# Altium project EDISON_ARDUINO_HVM_8_26_OLD.PrjPcb (part 2 of 2)

## Sheet 04) UART to USB debug p.SchDoc
size 386 x 246 mm
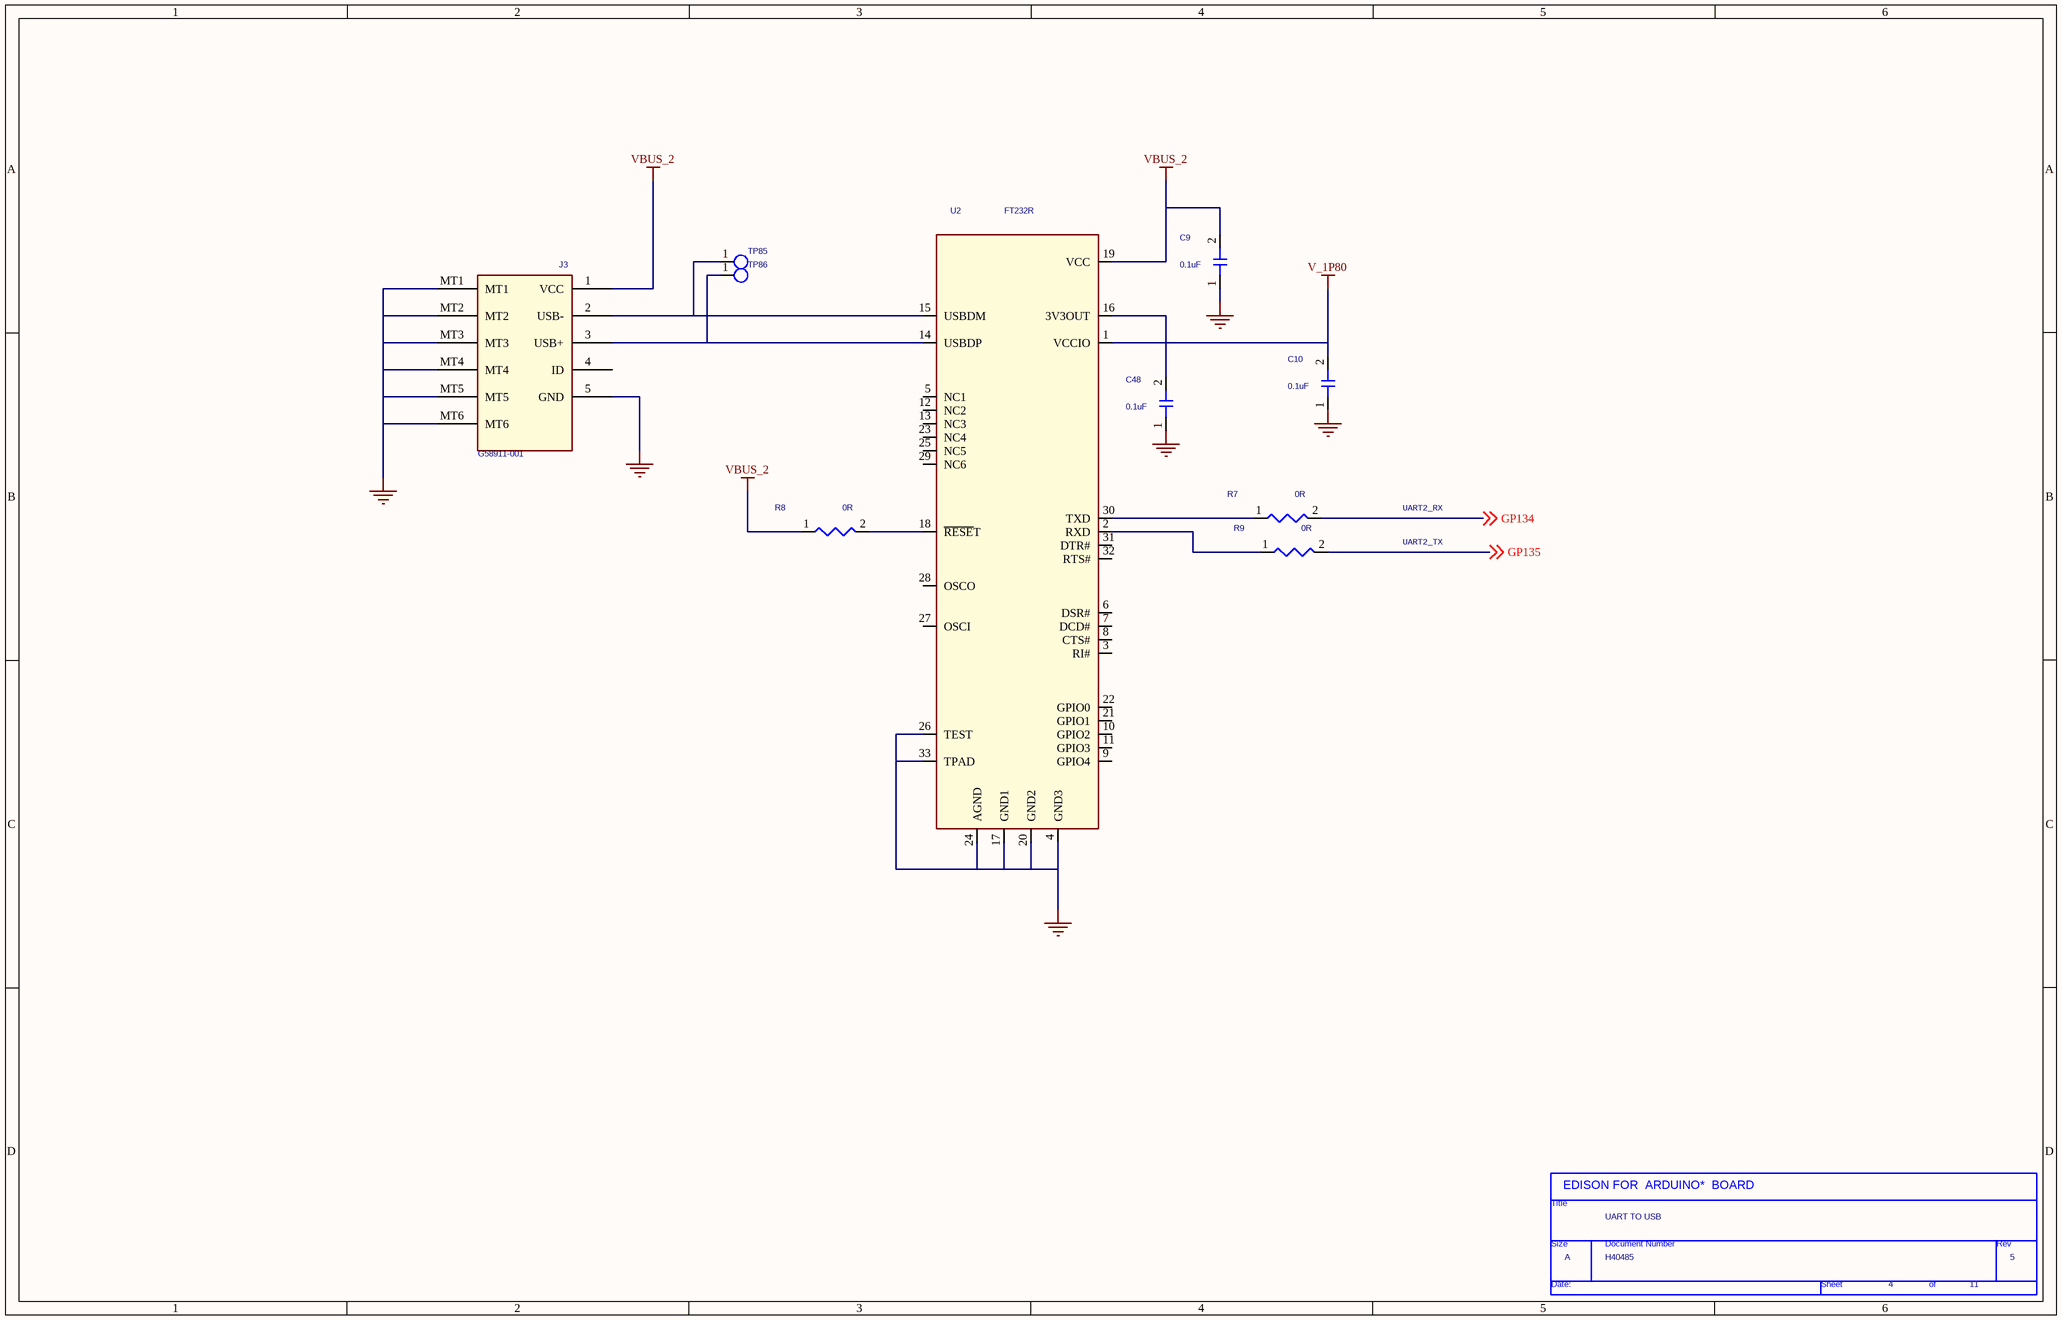
[diagram p13: 04) UART to USB debug p.SchDoc]

### Parts
(Parts that share a designator on the sheet are numbered #1, #2 ... from top to bottom, then left to right.)
*#8  Page Count: 11  Page Number: 4  Page Size: A  Title: UART TO USB  RevCode: 5  Doc: H40485  (hidden comment: TitleBlock0)  (graphical)
C9  0.1uF  [C0201]
C10  0.1uF  [C0201]
C48  0.1uF  [C0201]
J3  G58911-001  [RCPT_USB_5P_DIP_SM]
R7  0R  [0603.PRT]
R8  0R  [0603.PRT]
R9  0R  [0603.PRT]
TP85  30 MIL TESTPAD  [TESTPAD_C80]  (value not drawn)
TP86  30 MIL TESTPAD  [TESTPAD_C80]  (value not drawn)
U2  FT232R  [lcc32_p5mm_3p2sq_nonc]

### Nets
GND: C9.1(END1) C10.1(END1) C48.1(END1) J3.5(GND) J3.MT1 J3.MT2 J3.MT3 J3.MT4 J3.MT5 J3.MT6 U2.4(GND3) U2.17(GND1) U2.20(GND2) U2.24(AGND) U2.26(TEST) U2.33(TPAD)  [project net PWRBTN_GND]
V_1P80: C10.2(END2) U2.1(VCCIO)
VBUS_2: C9.2(END2) J3.1(VCC) R8.1 U2.19(VCC)
GP134: R7.2 ; off-sheet GP134
GP135: R9.2 ; off-sheet GP135
NetC48_2: C48.2(END2) U2.16(3V3OUT)
NetJ3_2: J3.2(USB-) TP85.1 U2.15(USBDM)
NetJ3_3: J3.3(USB+) TP86.1 U2.14(USBDP)
NetR7_1: R7.1 U2.30(TXD)
NetR8_2: R8.2 U2.18(~{RESE}T)
NetR9_1: R9.1 U2.2(RXD)

Not connected (* = marked no-connect by the designer): J3 4(ID); U2 3(RI#) 5(NC1) 6(DSR#) 7(DCD#) 8(CTS#) 9(GPIO4) 10(GPIO2) 11(GPIO3) 12(NC2) 13(NC3) 21(GPIO1) 22(GPIO0) 23(NC4) 25(NC5) 27(OSCI) 28(OSCO) 29(NC6) 31(DTR#) 32(RTS#)

### Notes on the sheet
- UART2_RX
- UART2_TX
- (in symbol TitleBlock0) EDISON FOR  ARDUINO*  BOARD; Title; Size; Document Number; Rev; Date:; Sheet; of

### Library data of the parts
C9 C10 C48 = CAP: as C49 on sheet 10) Button and I_O Conn; VOLTAGE: ?; PERC: ?; PATH: ?
J3 = CON4,USB,RA,_1: CONN,MISC,5P,MICRO USB,B TYPE,RECEPT,2013499-1; BOM: x; LEAD_FREE: YES; NO_STUFF: .; FINANCE: x; IPN: G58911-001; DEVICE: G58911-001; PART_NUMBER: G58911-001
R7 R8 = R_0: as R123 on sheet 10) Button and I_O Conn
R9 = R_0: as R10 on sheet 05) SPI ADC AND SWIZZLE
TP85 TP86 = TestPad,C80,SMT: as TP1 on sheet 11) TEST POINTS; BOM: x; PART_NUMBER: TESTPAD_30; NO_STUFF: NO_STUFF
U2 = FT232R_0: IC,VLSI,OTHER,FT232,QFN,32; PART_NUMBER: H40970-001; MFG PN: FT232RQ-REEL
*#8 = TitleBlock0: Page Create Date: March  8, 1995

## Sheet 01) Title Page.SchDoc
size 514 x 328 mm
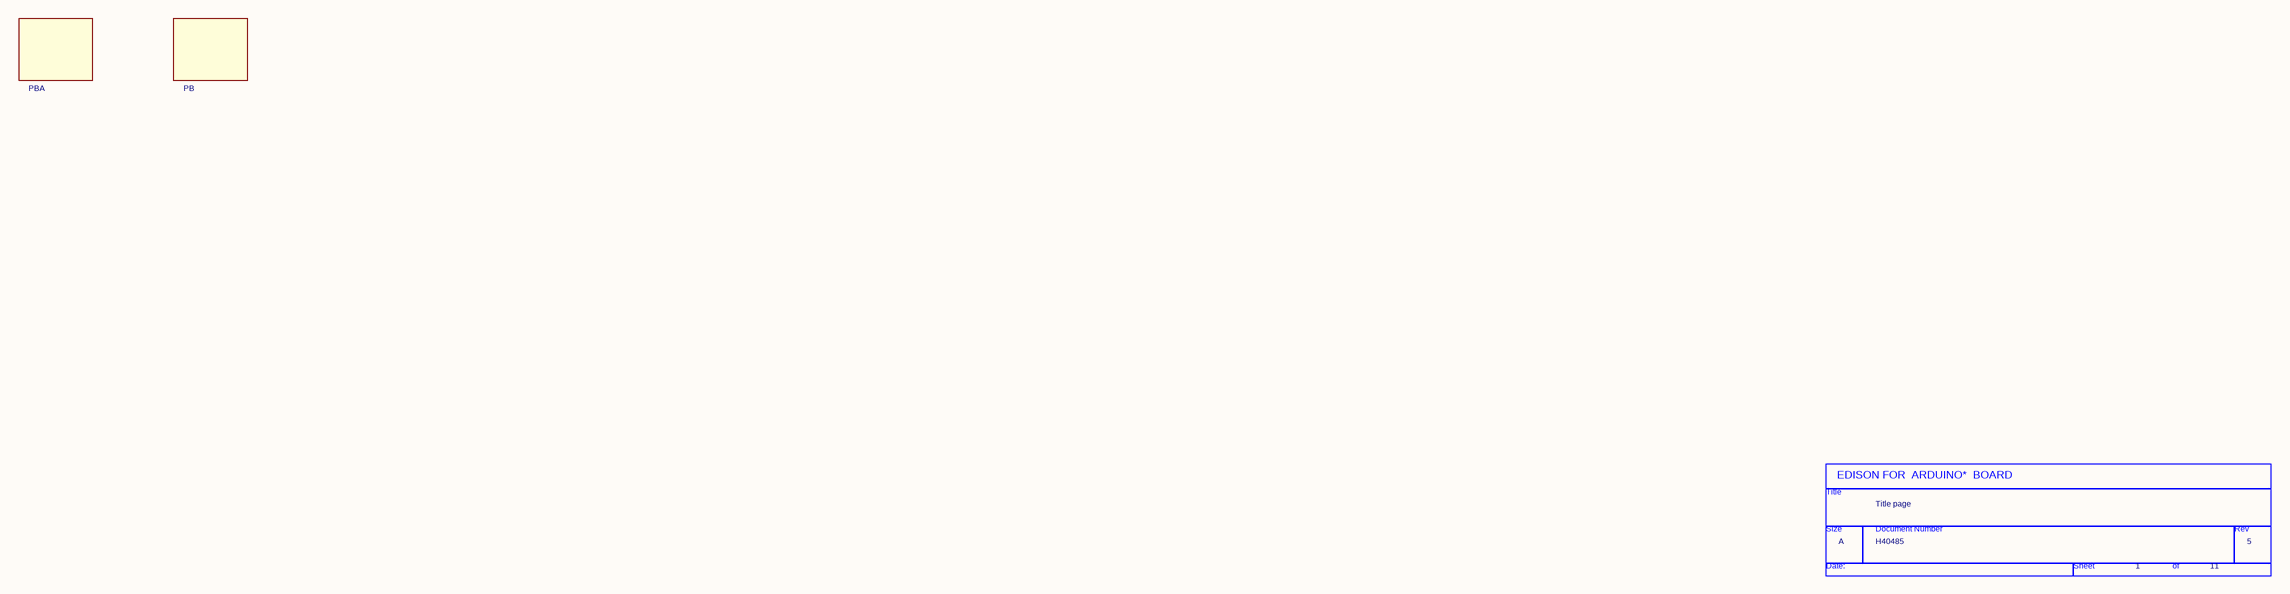
[diagram p14: 01) Title Page.SchDoc]

### Parts
(Parts that share a designator on the sheet are numbered #1, #2 ... from top to bottom, then left to right.)
*#9  Page Count: 11  Page Number: 1  Page Size: A  Title: Title page  RevCode: 5  Doc: H40485  (hidden comment: TitleBlock0)  (graphical)
A1  PBA
A2  PB

### Notes on the sheet
- (in symbol TitleBlock0) EDISON FOR  ARDUINO*  BOARD; Title; Size; Document Number; Rev; Date:; Sheet; of

### Library data of the parts
A1 = PBA: PBA, EDISON ARDUINO; PART_NUMBER: H40485-400
A2 = PBA: PB, EDISON ARDUINO, 1-UP; PART_NUMBER: H40482-004
*#9 = TitleBlock0: Page Create Date: March  8, 1995

## Sheet 03) POWER SUPPLIES.SchDoc
size 447 x 332 mm
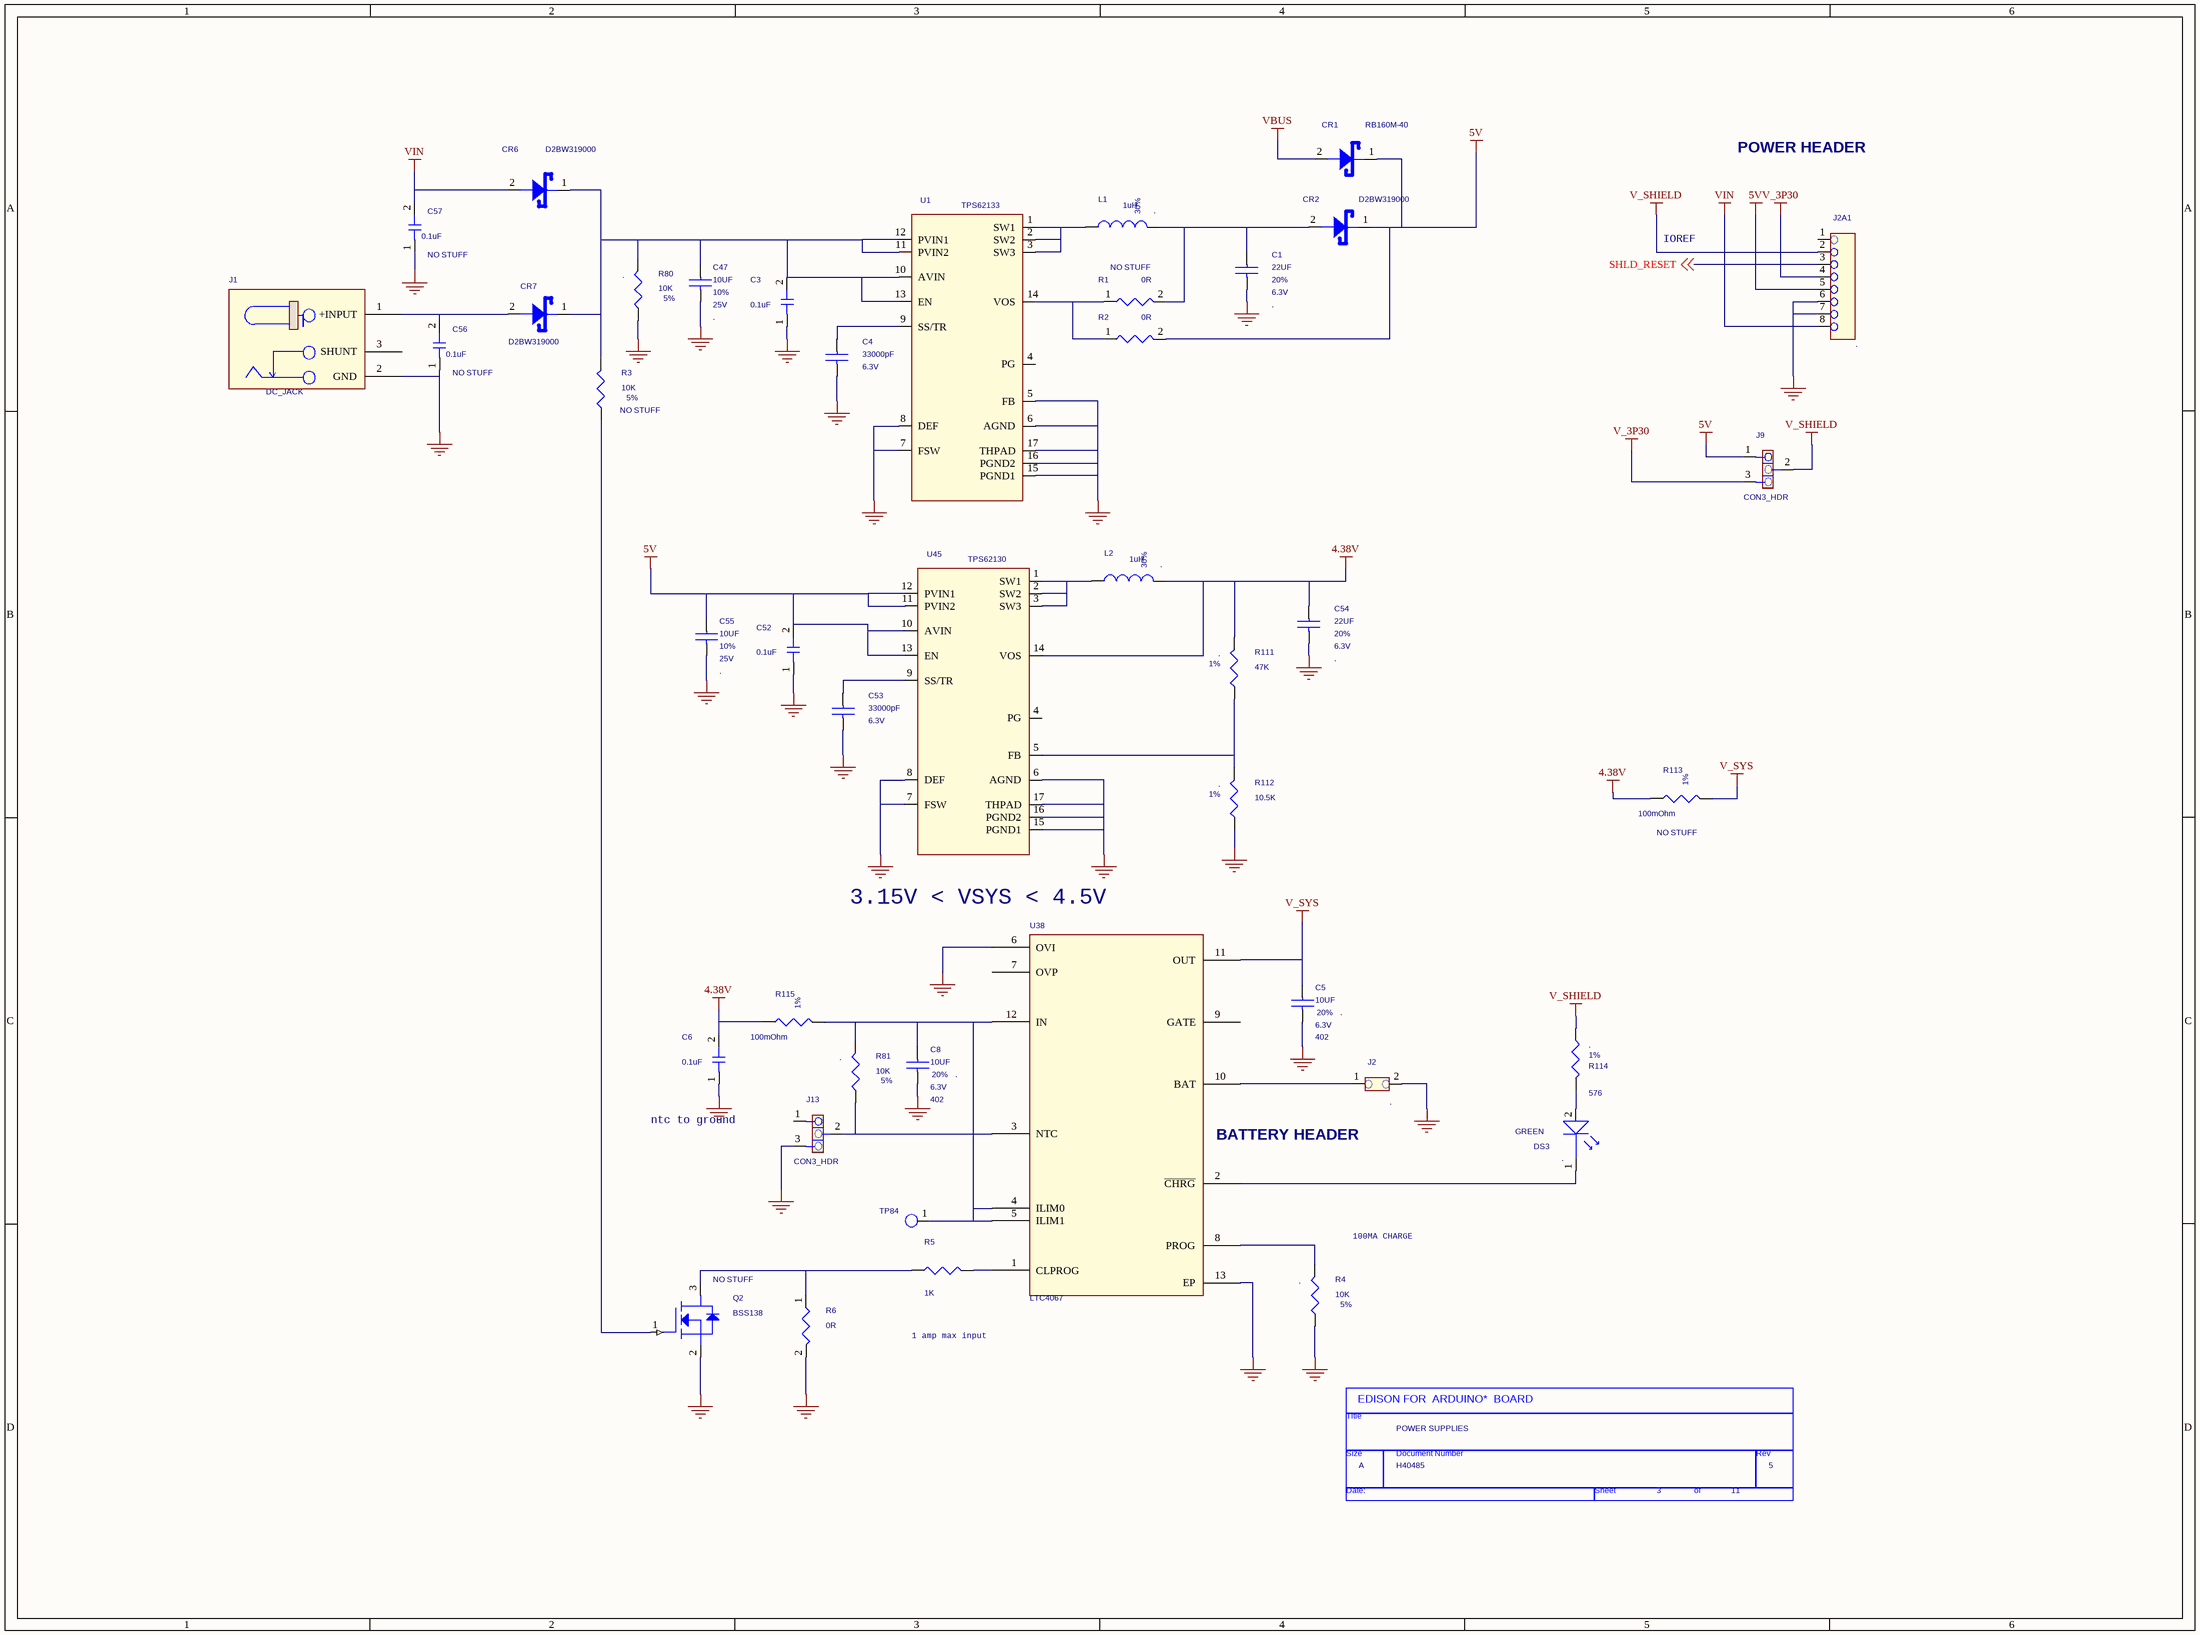
[diagram p15: 03) POWER SUPPLIES.SchDoc]

### Parts
(Parts that share a designator on the sheet are numbered #1, #2 ... from top to bottom, then left to right.)
*#10  Page Count: 11  Page Number: 3  Page Size: A  Title: POWER SUPPLIES  RevCode: 5  Doc: H40485  (hidden comment: TitleBlock0)  (graphical)
C1  22UF  TOLERANCE: 20%  RATING: 6.3V  NO_STUFF: .  [SMC0603_hi_value]
C3  0.1uF  [C0201]
C4  33000pF  RATING: 6.3V  [SMC0201]
C5  10UF  SIZE: 402  NO_STUFF: .  TOL: 20%  RATING: 6.3V  [SMC0402]
C6  0.1uF  [C0201]
C8  10UF  SIZE: 402  NO_STUFF: .  TOL: 20%  RATING: 6.3V  [SMC0402]
C47  10UF  RATING: 25V  NO_STUFF: .  TOL: 10%  [SMC0805_1p35h]
C52  0.1uF  [C0201]
C53  33000pF  RATING: 6.3V  [SMC0201]
C54  22UF  TOLERANCE: 20%  RATING: 6.3V  NO_STUFF: .  [SMC0603_hi_value]
C55  10UF  RATING: 25V  NO_STUFF: .  TOL: 10%  [SMC0805_1p35h]
C56  0.1uF  [C0201]
C57  0.1uF  [C0201]
CR1  RB160M-40  [SOD123_67x106]
CR2  D2BW319000  [SCR_27X17MA]
CR6  D2BW319000  [SCR_27X17MA]
CR7  D2BW319000  [SCR_27X17MA]
DS3  GREEN  NO_STUFF: .  [smled0402]
J1  DC_JACK  [JK_3P_RA]
J2  NO_STUFF: .  [102276-001]  (hidden comment: CON2_HDR)
J2A1  NO_STUFF: .  [1x8hdr_p100in_th]  (hidden comment: CON8_HDR)
J9  CON3_HDR  [1x3hdr_p100in_th]
J13  CON3_HDR  [1x3hdr_p100in_th]
L1  1uH  NO_STUFF: .  TOL: 30%  [SML0805]
L2  1uH  NO_STUFF: .  TOL: 30%  [SML0805]
Q2  BSS138  NO_STUFF: NO STUFF  [SOT23]
R1  0R  [0603.PRT]
R2  0R  [0603.PRT]
R3  10K  NO_STUFF: NO STUFF  TOL: 5%  [SMR0201]
R4  10K  NO_STUFF: .  TOL: 5%  [SMR0201]
R5  1K  [RC0603]
R6  0R  [0603.PRT]
R80  10K  NO_STUFF: .  TOL: 5%  [SMR0201]
R81  10K  NO_STUFF: .  TOL: 5%  [SMR0201]
R111  47K  TOL: 1%  NO_STUFF: .  [SMR0201]
R112  10.5K  TOL: 1%  NO_STUFF: .  [SMR0201]
R113  100mOhm  TOL: 1%  NO_STUFF: NO STUFF  [SMR0402]
R114  576  NO_STUFF: .  TOL: 1%  [SMR0201]
R115  100mOhm  TOL: 1%  [SMR0402]
TP84  30 MIL TESTPAD  [TESTPAD_C80]  (value not drawn)
U1  TPS62133  [QFN16_3X3]
U38  LTC4067  [lcc12_p5mm_3x4mm]
U45  TPS62130  [QFN16_3X3]

### Nets
4.38V: C6.2(END2) C54.1 L2.2 R111.2 R113.1 R115.1 U45.14(VOS)
5V: C52.2(END2) C55.1 CR1.1(Cathode) CR2.1(Cathode) J2A1.5 J9.1 R2.2 U45.10(AVIN) U45.11(PVIN2) U45.12(PVIN1) U45.13(EN)
GND: C1.2 C3.1(END1) C4.2 C5.2 C6.1(END1) C8.2 C47.2 C52.1(END1) C53.2 C54.2 C55.2 C56.1(END1) C57.1(END1) J1.2(GND) J2.2 J2A1.6 J2A1.7 J13.3 Q2.2(S) R4.1 R6.2 R80.1 R112.1 U1.5(FB) U1.6(AGND) U1.7(FSW) U1.8(DEF) U1.15(PGND1) U1.16(PGND2) U1.17(THPAD) U38.6(OVI) U38.13(EP) U45.6(AGND) U45.7(FSW) U45.8(DEF) U45.15(PGND1) U45.16(PGND2) U45.17(THPAD)  [project net PWRBTN_GND]
V_3P30: J2A1.4 J9.3
V_SHIELD: J2A1.2 J9.2 R114.2
V_SYS: C5.1 R113.2 U38.11(OUT)
VBUS: CR1.2(Anode)
VIN: C57.2(END2) CR6.2(Anode) J2A1.8
SHLD_RESET: J2A1.3 ; off-sheet SHLD_RESET
NetC1_1: C1.1 CR2.2(Anode) L1.2 R1.2
NetC3_2: C3.2(END2) C47.1 CR6.1(Cathode) CR7.1(Cathode) R3.2 R80.2 U1.10(AVIN) U1.11(PVIN2) U1.12(PVIN1) U1.13(EN)
NetC4_1: C4.1 U1.9(SS/TR)
NetC8_1: C8.1 R81.2 R115.2 TP84.1 U38.4(ILIM0) U38.5(ILIM1) U38.12(IN)
NetC53_1: C53.1 U45.9(SS/TR)
NetC56_2: C56.2(END2) CR7.2(Anode) J1.1(+INPUT)
NetDS3_1: DS3.1(LED1) U38.2(~{CHRG})
NetDS3_2: DS3.2(LED2) R114.1
NetJ2_1: J2.1 U38.10(BAT)
NetJ13_2: J13.2 R81.1 U38.3(NTC)
NetL1_1: L1.1 U1.1(SW1) U1.2(SW2) U1.3(SW3)
NetL2_1: L2.1 U45.1(SW1) U45.2(SW2) U45.3(SW3)
NetQ2_1: Q2.1(G) R3.1
NetQ2_3: Q2.3(D) R5.1 R6.1
NetR1_1: R1.1 R2.1 U1.14(VOS)
NetR4_2: R4.2 U38.8(PROG)
NetR5_2: R5.2 U38.1(CLPROG)
NetR111_1: R111.1 R112.2 U45.5(FB)

Not connected (* = marked no-connect by the designer): J1 3(SHUNT); J2A1 1; J13 1; U1 4(PG); U38 7(OVP) 9(GATE); U45 4(PG)

### Notes on the sheet
- POWER HEADER
- IOREF
- 3.15V < VSYS < 4.5V
- (near C6) ntc to ground
- (near U38) BATTERY HEADER
- 100MA CHARGE
- 1 amp max input
- (in symbol TitleBlock0) EDISON FOR  ARDUINO*  BOARD; Title; Size; Document Number; Rev; Date:; Sheet; of

### Library data of the parts
C1 C54 = CAPC,X5R,0603,6.3V,20%,22UF: CAPC,X5R,0603,22.000UF,6.300V,+/- 20%; Device: 602433-081; LEAD_FREE: YES; BOM: x; IPN: 602433-081; PART_NUMBER: 602433-081; FINANCE: x
C3 C57 = CAP: CAPC,X5R,0201,0.1UF,25.00V,+/- 10%; Manufacturer: GENERIC; PART_NUMBER: C83410-027; OriginalSymbolOrigin: (-50,50); Code: 27; Process: SMD; VOLTAGE: ?; PERC: ?; PATH: ?
  C57: NO STUFF: NO STUFF
C4 C53 = CAPC,X5R,0201,6.3V,10%,33000pF: CAPC,X5R,0201,0.033UF,6.3V,+/- 10%; PART_NUMBER: C83410-017; LEAD_FREE: YES; BOM: x; NO_STUFF: .; IPN: C83410-017; Device: C83410-017; FINANCE: x
C5 C8 = CAPC,X5R,0402,6.3V,20%,10uF: CAP C,10UF,0402,X5R,6.3V,+/-20%,; PART_NUMBER: A36096-114; Device: G21049-001; LEAD_FREE: YES; BOM: x; IPN: G21049-001; FINANCE: x
C6 C52 = CAP: CAPC,X5R,0201,0.1UF,10.00V,+/- 10%; PART_NUMBER: C83410-014; Manufacturer: GENERIC; OriginalSymbolOrigin: (-50,50); Process: SMD; Code: 27; VOLTAGE: ?; PERC: ?; PATH: ?
C47 C55 = CAPC,X7R,0805,50V,10%,1.0uF: CAPC,X5R,0805,10.00UF,25.00V,+/- 10%; FINANCE: x; LEAD_FREE: YES; IPN: G27061-002; BOM: x; Device: G27061-002; PART_NUMBER: G27061-002; PART NUMBER: G27061-002
C56 = CAP: CAPC,X5R,0201,0.1UF,25.00V,+/- 10%; PART_NUMBER: C83410-027; Manufacturer: GENERIC; OriginalSymbolOrigin: (-50,50); Process: SMD; Code: 27; VOLTAGE: ?; PERC: ?; PATH: ?; NO STUFF: NO STUFF
CR1 = DIO,SHTKY,SOD123,RB160M-40: DIODE SHKY 1A 40V SOD123; Manufacturer P/N: RM160M-40; Manufacturer: Pillips; FINANCE: x; LEAD_FREE: YES; IPN: E58800-001; NO_STUFF: .; Device: E58800-001; BOM: x; PART_NUMBER: E58800-001
CR2 CR6 CR7 = DIO,SHTKY,DB2W319000L: DIODE SHKY 1A 40V SOD123; PART NUMBER: H33384-001; Manufacturer: Pillips; Decsription: IC,DS,DIO,SMT,DB2W31900L,SHTKY,; FINANCE: x; LEAD_FREE: YES; NO_STUFF: .; Manufacturer P/N: DB2W319000L; IPN: H33384-001; Device: H33384-001; BOM: x; PART_NUMBER: H33384-001
DS3 = LED,SMT,GREEN,V,0402: LED,1005,SM,GRN,V,1.00,RC,1; Device: E54986-003; LEAD_FREE: YES; BOM: x; IPN: E54986-003; PART_NUMBER: E54986-003; FINANCE: x
J1 = TMP_091753: CONN,JACK,PWR,2.0MM,TH,PJ-002AH; MFR P/N: PJ-014D; MFR: CUI INC; PART_NUMBER: G60557-001; FINANCE: x; LEAD_FREE: YES; NO_STUFF: .; BOM: x; Device: G60557-001; IPN: G60557-001
J2 = CON2,HDR,TH,0.1in,A91829-020: CONN,HDR,1 X 2,PLG,VT,0.1,093ST,KP; PART_NUMBER: E81838-001; LEAD_FREE: YES; Device: E81838-001; IPN: E81838-001; BOM: x; FINANCE: x
J2A1 = CON8,HDR,TH,0.1in,E70026-001: CONN,PLUG,VERT,1X8,2.54MM,THM,90147_1108; FINANCE: x; LEAD_FREE: YES; IPN: H46118-001; BOM: x; Device: H46118-001; PART_NUMBER: H46118-001
J9 J13 = CON3,HDR,TH,0.1in,A91829-009: CONN,HDR,1 X 3,PLG,VT,0.1,062ST,KP; IPN: A91829-001; LEAD_FREE: YES; NO_STUFF: .; Device: A91829-001; BOM: x; FINANCE: x; PART_NUMBER: A91829-001
L1 L2 = INDCT,1uH,1.1A,30%,0805: INDCT,MTILAYER,1.00uH,1.1A,0805,30.0%,; MANUFACTURER P/N: MIPSZ2012D1R0; FINANCE: x; LEAD_FREE: YES; IPN: G95926-001; ROOM: NO_ROOM; MFG: Murata; BOM: x; Device: G95926-001; PART_NUMBER: G95926-001
Q2 = XSTR,BSS138,FET,NCH,SOT23: IC,DS,FET N,SOT-23,BSS138LT3G; FINANCE: x; LEAD_FREE: YES; Device: C81974-001; BOM: x; IPN: C81974-001; PART_NUMBER: C81974-001
R1 R6 = R_0: RES_D,0201,0.00OHM,1/20W; PART_NUMBER: C80792-009; Manufacturer: Yageo
  R1: NO STUFF: NO STUFF
R2 = R_0: RES_D,0201,0.00OHM,1/20W; Manufacturer: Yageo; PART_NUMBER: C80792-009
R3 R4 R80 R81 = RESD,0201,5%,1/20W,10K: RES D,0201,10.00 kOHM,5.00%,1/20W,YES; Device: C80792-002; BOM: x; ROOM: AUDIO_CODEC; RATING: 1/20W; IPN: C80792-002; PART_NUMBER: C80792-002; LEAD_FREE: YES; FINANCE: x
R5 = R0603: RES_D,0201,1.00kOHM,1.00%,1/20W; PART_NUMBER: C48657-010; Manufacturer: Yageo; Part Type: Resister
R111 = RESD,0201,1%,1/20W,47K: RES_D,0201,47.0kOHM,1.00%,1/20W,; PART_NUMBER: C48657-118; FINANCE: x; LEAD_FREE: YES; BOM: x; IPN: C48657-118; RATING: 1/20W; Device: C48657-118
R112 = RESD,0201,1%,1/20W,47K: RES_D,0201,10.50kOHM,1.00%,1/20W,; PART_NUMBER: C48657-088; FINANCE: x; LEAD_FREE: YES; BOM: x; IPN: C48657-088; RATING: 1/20W; Device: C48657-088
R113 R115 = RESD,0402,1%,1/16W,100mOhm: RES D,0402,0.10 OHM,1.00%,,1/16W; PART_NUMBER: C65288-008; LEAD_FREE: YES; BOM: x; IPN: C65288-008; RATING: 1/16W; Device: C65288-008; FINANCE: x
R114 = RESD,0201,1%,1/20W,562: RES D,0402,576.00 OHM,1.00%,1/16W,YES; PART_NUMBER: A93548-403; RATING: 1/20W; BOM: x; LEAD_FREE: YES; FINANCE: x
TP84 = TestPad,C80,SMT: LEAD_FREE: NO; FINANCE: x; IPN: TESTPAD_80; DEVICE: TESTPAD_30; ROOM: TEST_APE; BOM: x; PART_NUMBER: TESTPAD_30; NO_STUFF: NO_STUFF
U1 = TPS62133_0: IC,LIN,QFN,TPS62133,CONTROLR; Part_Number: H31879-001; PART NUMBER: H31879-001
U38 = IC,LTC4067,QFN12,USB_PWR_MNGR_1: C,LIN,DFN,LTC4067,CONTROLR; IPN: G38734-001; NO_STUFF: .; LEAD_FREE: YES; BOM: x; DEVICE: G38734-001; PART_NUMBER: G38734-001; FINANCE: x
U45 = TPS62133_0: IC,LIN,QFN,TPS62131,CONTROLR; PART NUMBER: G51818-004; Part_Number: G51818-004
*#10 = TitleBlock0: Page Create Date: March  8, 1995

## Sheet 02) Table of Contents.SchDoc
size 246 x 182 mm
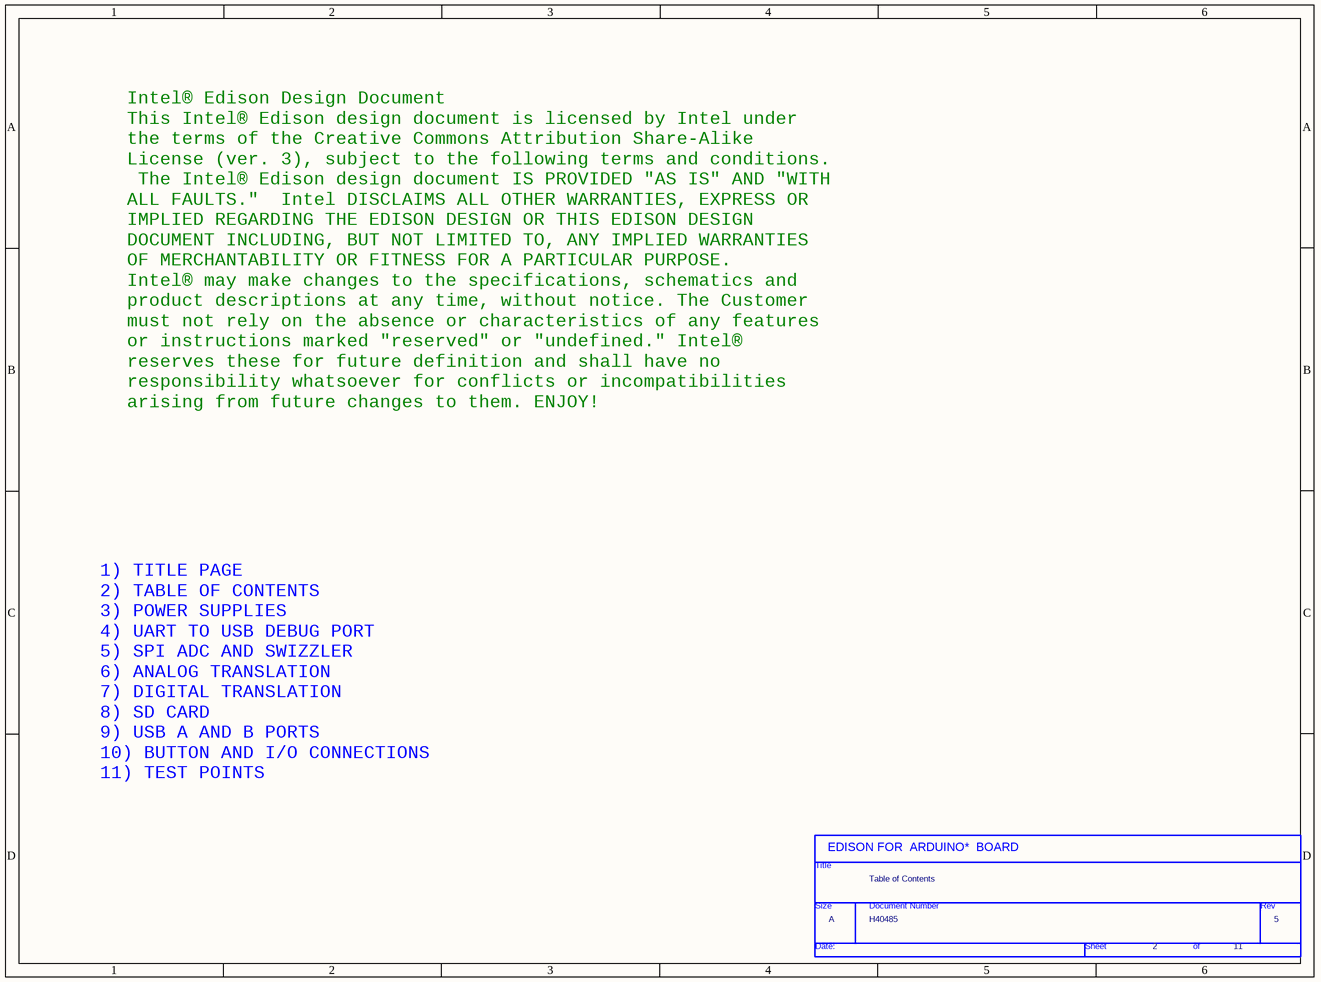
[diagram p16: 02) Table of Contents.SchDoc]

### Parts
(Parts that share a designator on the sheet are numbered #1, #2 ... from top to bottom, then left to right.)
*#11  Page Count: 11  Page Number: 2  Page Size: A  Title: Table of Contents  RevCode: 5  Doc: H40485  (hidden comment: TitleBlock0)  (graphical)

### Notes on the sheet
- Intel® Edison Design Document
  This Intel® Edison design document is licensed by Intel under
  the terms of the Creative Commons Attribution Share-Alike
  License (ver. 3), subject to the following terms and conditions.
  The Intel® Edison design document IS PROVIDED "AS IS" AND "WITH
  ALL FAULTS."  Intel DISCLAIMS ALL OTHER WARRANTIES, EXPRESS OR
  IMPLIED REGARDING THE EDISON DESIGN OR THIS EDISON DESIGN
  DOCUMENT INCLUDING, BUT NOT LIMITED TO, ANY IMPLIED WARRANTIES
  OF MERCHANTABILITY OR FITNESS FOR A PARTICULAR PURPOSE.
  Intel® may make changes to the specifications, schematics and
  product descriptions at any time, without notice. The Customer
  must not rely on the absence or characteristics of any features
  or instructions marked "reserved" or "undefined." Intel®
  reserves these for future definition and shall have no
  responsibility whatsoever for conflicts or incompatibilities
  arising from future changes to them. ENJOY!
- 1) TITLE PAGE
  2) TABLE OF CONTENTS
  3) POWER SUPPLIES
  4) UART TO USB DEBUG PORT
  5) SPI ADC AND SWIZZLER
  6) ANALOG TRANSLATION
  7) DIGITAL TRANSLATION
  8) SD CARD
  9) USB A AND B PORTS
  10) BUTTON AND I/O CONNECTIONS
  11) TEST POINTS
- (in symbol TitleBlock0) EDISON FOR  ARDUINO*  BOARD; Title; Size; Document Number; Rev; Date:; Sheet; of

### Library data of the parts
*#11 = TitleBlock0: Page Create Date: March  8, 1995

## Nets that join several sheets
5V: 09) USB (CR9.2 U36.6), 07) DIGITAL TRANSLATION (J4.2), 05) SPI ADC AND SWIZZLE (FB1.2), 03) POWER SUPPLIES (11 pins)
PWRBTN_GND: 11) TEST POINTS (7 pins), 10) Button and I_O Conn (25 pins), 09) USB (24 pins), 08) SD card (11 pins), 07) DIGITAL TRANSLATION (57 pins), 06) ANALOG TRANSLATION (56 pins), 05) SPI ADC AND SWIZZLE (17 pins), 04) UART to USB debug p (16 pins), 03) POWER SUPPLIES (38 pins)
V_1P80: 11) TEST POINTS (R85.2 TP11.1), 10) Button and I_O Conn (5 pins), 09) USB (R36.2), 08) SD card (C31.2 R45.1 R46.1 U35.A2), 07) DIGITAL TRANSLATION (28 pins), 06) ANALOG TRANSLATION (21 pins), 05) SPI ADC AND SWIZZLE (C13.1 C14.2 U3.21), 04) UART to USB debug p (C10.2 U2.1)
V_1P80_IO: 10) Button and I_O Conn (C50.2 Q13.2 Q13.3 R107.1), 07) DIGITAL TRANSLATION (U34.18 U34.21 U34.23), 06) ANALOG TRANSLATION (C21.2 R122.2 U16.21 U16.23)
V_3P30: 11) TEST POINTS (TP7.1 TP9.1), 10) Button and I_O Conn (J14.2 R83.1), 09) USB (EU1.10), 03) POWER SUPPLIES (J2A1.4 J9.3)
V_SHIELD: 10) Button and I_O Conn (Q12.4 R100.1), 07) DIGITAL TRANSLATION (R19.2), 06) ANALOG TRANSLATION (17 pins), 05) SPI ADC AND SWIZZLE (J8.1), 03) POWER SUPPLIES (J2A1.2 J9.2 R114.2)
V_SHIELD_SW: 07) DIGITAL TRANSLATION (14 pins), 06) ANALOG TRANSLATION (9 pins)
V_SHLD_IO: 10) Button and I_O Conn (C51.2 Q12.2 Q12.3 R108.1), 06) ANALOG TRANSLATION (13 pins)
V_SYS: 11) TEST POINTS (R86.2 TP1.1 TP3.1 TP5.1), 10) Button and I_O Conn (Q14.4 R48.1 R104.1 R105.1), 08) SD card (C32.2 U35.B2), 07) DIGITAL TRANSLATION (R88.2), 03) POWER SUPPLIES (C5.1 R113.2 U38.11)
VBUS: 11) TEST POINTS (TP18.1), 10) Button and I_O Conn (J7.20), 09) USB (Q10.2 Q10.3), 03) POWER SUPPLIES (CR1.2)
A0: 11) TEST POINTS (TP64.1), 06) ANALOG TRANSLATION (J1A1.1 R52.2 U15.A1)
A1: 11) TEST POINTS (TP65.1), 06) ANALOG TRANSLATION (J1A1.2 R53.2 U13.A1)
A2: 11) TEST POINTS (TP66.1), 06) ANALOG TRANSLATION (J1A1.3 R54.2 U11.A1)
A3: 11) TEST POINTS (TP67.1), 06) ANALOG TRANSLATION (J1A1.4 R55.2 U9.A1)
A4: 11) TEST POINTS (TP68.1), 07) DIGITAL TRANSLATION (J2B1.9), 06) ANALOG TRANSLATION (J1A1.5 R56.2 U7.A1)
A5: 11) TEST POINTS (TP69.1), 07) DIGITAL TRANSLATION (J2B1.10), 06) ANALOG TRANSLATION (J1A1.6 R57.2 U5.A1)
AIN0: 06) ANALOG TRANSLATION (U15.C2), 05) SPI ADC AND SWIZZLE (R74.2)
AIN1: 06) ANALOG TRANSLATION (U13.C2), 05) SPI ADC AND SWIZZLE (R75.2)
AIN2: 06) ANALOG TRANSLATION (U11.C2), 05) SPI ADC AND SWIZZLE (R76.2)
AIN3: 06) ANALOG TRANSLATION (U9.C2), 05) SPI ADC AND SWIZZLE (R77.2)
AIN4: 06) ANALOG TRANSLATION (U7.C2), 05) SPI ADC AND SWIZZLE (R78.2)
AIN5: 06) ANALOG TRANSLATION (U5.C2), 05) SPI ADC AND SWIZZLE (R79.2)
AREF: 07) DIGITAL TRANSLATION (J2B1.8), 05) SPI ADC AND SWIZZLE (J8.3)
DIG0: 11) TEST POINTS (TP70.1), 07) DIGITAL TRANSLATION (J1B1.1 U33.C2), 06) ANALOG TRANSLATION (R64.2)
DIG1: 11) TEST POINTS (TP71.1), 07) DIGITAL TRANSLATION (J1B1.2 U31.C2), 06) ANALOG TRANSLATION (R65.2)
DIG2: 11) TEST POINTS (TP72.1), 07) DIGITAL TRANSLATION (J1B1.3 U29.C2), 06) ANALOG TRANSLATION (R66.2)
DIG3: 11) TEST POINTS (TP73.1), 07) DIGITAL TRANSLATION (J1B1.4 U27.C2), 06) ANALOG TRANSLATION (R67.2)
DIG4: 11) TEST POINTS (TP74.1), 07) DIGITAL TRANSLATION (J1B1.5 U24.C2), 06) ANALOG TRANSLATION (R68.2)
DIG5: 11) TEST POINTS (TP75.1), 07) DIGITAL TRANSLATION (J1B1.6 U21.C2), 06) ANALOG TRANSLATION (R69.2)
DIG6: 11) TEST POINTS (TP76.1), 07) DIGITAL TRANSLATION (J1B1.7 U19.C2), 06) ANALOG TRANSLATION (R70.2)
DIG7: 11) TEST POINTS (TP77.1), 07) DIGITAL TRANSLATION (J1B1.8 U32.C2), 06) ANALOG TRANSLATION (R71.2)
DIG8: 11) TEST POINTS (TP78.1), 07) DIGITAL TRANSLATION (J2B1.1 U30.C2), 06) ANALOG TRANSLATION (R58.2)
DIG9: 11) TEST POINTS (TP79.1), 07) DIGITAL TRANSLATION (J2B1.2 U28.C2), 06) ANALOG TRANSLATION (R59.2)
DIG10: 11) TEST POINTS (TP80.1), 07) DIGITAL TRANSLATION (J2B1.3 U26.C2), 06) ANALOG TRANSLATION (R60.2)
DIG11: 11) TEST POINTS (TP81.1), 07) DIGITAL TRANSLATION (J2B1.4 J4.4 U23.C2), 06) ANALOG TRANSLATION (R61.2)
DIG12: 11) TEST POINTS (TP82.1), 07) DIGITAL TRANSLATION (J2B1.5 J4.1 U20.C2), 06) ANALOG TRANSLATION (R62.2)
DIG13: 11) TEST POINTS (TP83.1), 07) DIGITAL TRANSLATION (J2B1.6 J4.3 U18.C2), 06) ANALOG TRANSLATION (R63.2)
FAULT: 11) TEST POINTS (TP19.1), 10) Button and I_O Conn (J7.19), 09) USB (R36.1 U36.3)
FW_RCVR: 11) TEST POINTS (TP63.1), 10) Button and I_O Conn (J7.69 SW1UI3.1)
GP12_PWM0: 11) TEST POINTS (TP34.1), 10) Button and I_O Conn (J7.35), 05) SPI ADC AND SWIZZLE (J12.2)
GP13_PWM1: 11) TEST POINTS (TP32.1), 10) Button and I_O Conn (J7.33), 05) SPI ADC AND SWIZZLE (J11.2)
GP14: 11) TEST POINTS (TP41.1), 10) Button and I_O Conn (J7.48), 06) ANALOG TRANSLATION (U6.C1)
GP15: 11) TEST POINTS (TP88.1), 10) Button and I_O Conn (J7.42), 06) ANALOG TRANSLATION (R122.1 U17.22)
GP19: 11) TEST POINTS (TP37.1), 10) Button and I_O Conn (J7.41), 07) DIGITAL TRANSLATION (U34.19), 06) ANALOG TRANSLATION (Q6.2 R44.1 U16.19)
GP20: 11) TEST POINTS (TP38.1), 10) Button and I_O Conn (J7.43), 07) DIGITAL TRANSLATION (U34.20), 06) ANALOG TRANSLATION (Q5.2 R43.1 U16.20)
GP27: 11) TEST POINTS (TP40.1), 10) Button and I_O Conn (J7.45), 06) ANALOG TRANSLATION (Q3.2 R39.1)
GP28: 11) TEST POINTS (TP42.1), 10) Button and I_O Conn (J7.47), 06) ANALOG TRANSLATION (Q4.2 R40.1)
GP40: 11) TEST POINTS (TP44.1), 10) Button and I_O Conn (J7.52), 07) DIGITAL TRANSLATION (U43.B2)
GP41: 11) TEST POINTS (TP46.1), 10) Button and I_O Conn (J7.54), 07) DIGITAL TRANSLATION (U40.B2)
GP42: 11) TEST POINTS (TP43.1), 10) Button and I_O Conn (J7.50), 07) DIGITAL TRANSLATION (U42.B2)
GP43: 11) TEST POINTS (TP48.1), 10) Button and I_O Conn (J7.56), 07) DIGITAL TRANSLATION (U41.B2)
GP44: 11) TEST POINTS (TP22.1), 10) Button and I_O Conn (J7.24), 06) ANALOG TRANSLATION (U14.C1)
GP45: 11) TEST POINTS (TP24.1), 10) Button and I_O Conn (J7.26), 06) ANALOG TRANSLATION (U12.C1)
GP46: 11) TEST POINTS (TP26.1), 10) Button and I_O Conn (J7.28), 06) ANALOG TRANSLATION (U10.C1)
GP47: 11) TEST POINTS (TP28.1), 10) Button and I_O Conn (J7.30), 06) ANALOG TRANSLATION (U8.C1)
GP48: 11) TEST POINTS (TP29.1), 10) Button and I_O Conn (J7.32), 07) DIGITAL TRANSLATION (U32.C1)
GP49: 11) TEST POINTS (TP31.1), 10) Button and I_O Conn (J7.34), 07) DIGITAL TRANSLATION (U30.C1)
GP77: 11) TEST POINTS (TP52.1), 10) Button and I_O Conn (J7.60), 08) SD card (J5.9 R45.2 U35.A3)
GP78: 11) TEST POINTS (TP50.1), 10) Button and I_O Conn (J7.58), 08) SD card (U35.D2)
GP79: 11) TEST POINTS (TP54.1), 10) Button and I_O Conn (J7.62), 08) SD card (U35.C1)
GP80: 11) TEST POINTS (TP58.1), 10) Button and I_O Conn (J7.66), 08) SD card (U35.D1)
GP81: 11) TEST POINTS (TP62.1), 10) Button and I_O Conn (J7.70), 08) SD card (U35.E1)
GP82: 11) TEST POINTS (TP56.1), 10) Button and I_O Conn (J7.64), 08) SD card (U35.A1)
GP83: 11) TEST POINTS (TP60.1), 10) Button and I_O Conn (J7.68), 08) SD card (U35.B1)
GP84: 11) TEST POINTS (TP87.1), 10) Button and I_O Conn (J7.44), 08) SD card (U35.E2)
GP109: 11) TEST POINTS (TP49.1), 10) Button and I_O Conn (J7.55), 07) DIGITAL TRANSLATION (U43.C2), 05) SPI ADC AND SWIZZLE (U3.17)
GP110: 11) TEST POINTS (TP47.1), 10) Button and I_O Conn (J7.53), 05) SPI ADC AND SWIZZLE (U3.16)
GP111: 11) TEST POINTS (TP45.1), 10) Button and I_O Conn (J7.51), 07) DIGITAL TRANSLATION (U40.C2 U44.1)
GP114: 11) TEST POINTS (TP53.1), 10) Button and I_O Conn (J7.59), 07) DIGITAL TRANSLATION (U44.4), 05) SPI ADC AND SWIZZLE (U3.19)
GP115: 11) TEST POINTS (TP51.1), 10) Button and I_O Conn (J7.57), 07) DIGITAL TRANSLATION (U41.C2), 05) SPI ADC AND SWIZZLE (U3.18)
GP128: 11) TEST POINTS (TP59.1), 10) Button and I_O Conn (J7.65), 07) DIGITAL TRANSLATION (U29.C1)
GP129: 11) TEST POINTS (TP57.1), 10) Button and I_O Conn (J7.63), 07) DIGITAL TRANSLATION (U24.C1)
GP130: 11) TEST POINTS (TP55.1), 10) Button and I_O Conn (J7.61), 07) DIGITAL TRANSLATION (U33.C1)
GP131: 11) TEST POINTS (TP39.1), 10) Button and I_O Conn (J7.46), 07) DIGITAL TRANSLATION (U31.C1)
GP134: 11) TEST POINTS (TP20.1), 10) Button and I_O Conn (J7.22), 04) UART to USB debug p (R7.2)
GP135: 11) TEST POINTS (TP27.1), 10) Button and I_O Conn (J7.27), 04) UART to USB debug p (R9.2)
GP165: 11) TEST POINTS (TP25.1), 10) Button and I_O Conn (J7.25), 06) ANALOG TRANSLATION (U4.C1)
GP182_PWM2: 11) TEST POINTS (TP35.1), 10) Button and I_O Conn (J7.37), 05) SPI ADC AND SWIZZLE (J12.4)
GP183_PWM3: 11) TEST POINTS (TP36.1), 10) Button and I_O Conn (J7.39), 05) SPI ADC AND SWIZZLE (J11.4)
GPI_PWRBTN_N: 11) TEST POINTS (TP17.1), 10) Button and I_O Conn (J7.17 R49.1)
MSIC_SLPCLK_2: 11) TEST POINTS (TP8.1), 10) Button and I_O Conn (J7.7)
OSC_CLK_OUT_0: 11) TEST POINTS (TP61.1), 10) Button and I_O Conn (J7.67)
PSW: 11) TEST POINTS (TP21.1), 10) Button and I_O Conn (J7.21), 09) USB (R37.1 U36.4)
PWM0_OUT: 07) DIGITAL TRANSLATION (R91.1 U27.C1), 05) SPI ADC AND SWIZZLE (J12.1)
PWM1_OUT: 07) DIGITAL TRANSLATION (R90.1 U21.C1), 05) SPI ADC AND SWIZZLE (J11.1)
PWM2_OUT: 07) DIGITAL TRANSLATION (R89.1 U19.C1), 05) SPI ADC AND SWIZZLE (J12.3)
PWM3_OUT: 07) DIGITAL TRANSLATION (R92.1 U28.C1), 05) SPI ADC AND SWIZZLE (J11.3)
PWM4_OUT: 07) DIGITAL TRANSLATION (R94.1 U25.B2), 05) SPI ADC AND SWIZZLE (J12.5)
PWM5_OUT: 07) DIGITAL TRANSLATION (R93.1 U22.B2), 05) SPI ADC AND SWIZZLE (J11.5)
RCVR_MODE: 11) TEST POINTS (TP30.1), 10) Button and I_O Conn (J7.31 SW1UI4.1)
RESETOUT#: 11) TEST POINTS (Q8.1 R85.1 TP33.1), 10) Button and I_O Conn (J7.36 R123.2)
SHLD_RESET: 07) DIGITAL TRANSLATION (C34.1 J4.5 R19.1 SW1UI1.1), 06) ANALOG TRANSLATION (U17.8 U17.17), 03) POWER SUPPLIES (J2A1.3)
SPI_CLK_SEL: 07) DIGITAL TRANSLATION (U43.D2), 06) ANALOG TRANSLATION (U16.13)
SPI_FS_SEL: 07) DIGITAL TRANSLATION (U40.D2), 06) ANALOG TRANSLATION (U16.10)
SPI_RXD_SEL: 07) DIGITAL TRANSLATION (U42.D2), 06) ANALOG TRANSLATION (U16.12)
SPI_TXD_SEL: 07) DIGITAL TRANSLATION (U41.D2), 06) ANALOG TRANSLATION (U16.11)
USB_DN: 11) TEST POINTS (TP16.1), 10) Button and I_O Conn (J7.18), 09) USB (EU1.7)
USB_DP: 11) TEST POINTS (TP14.1), 10) Button and I_O Conn (J7.16), 09) USB (EU1.8)
USB_ID: 11) TEST POINTS (TP4.1), 10) Button and I_O Conn (J7.3), 09) USB (Q11.3)
V_VBAT_BKUP: 11) TEST POINTS (TP23.1), 10) Button and I_O Conn (J7.23)